# EAGLE design buderus_ems (EAGLE 9.2.2)
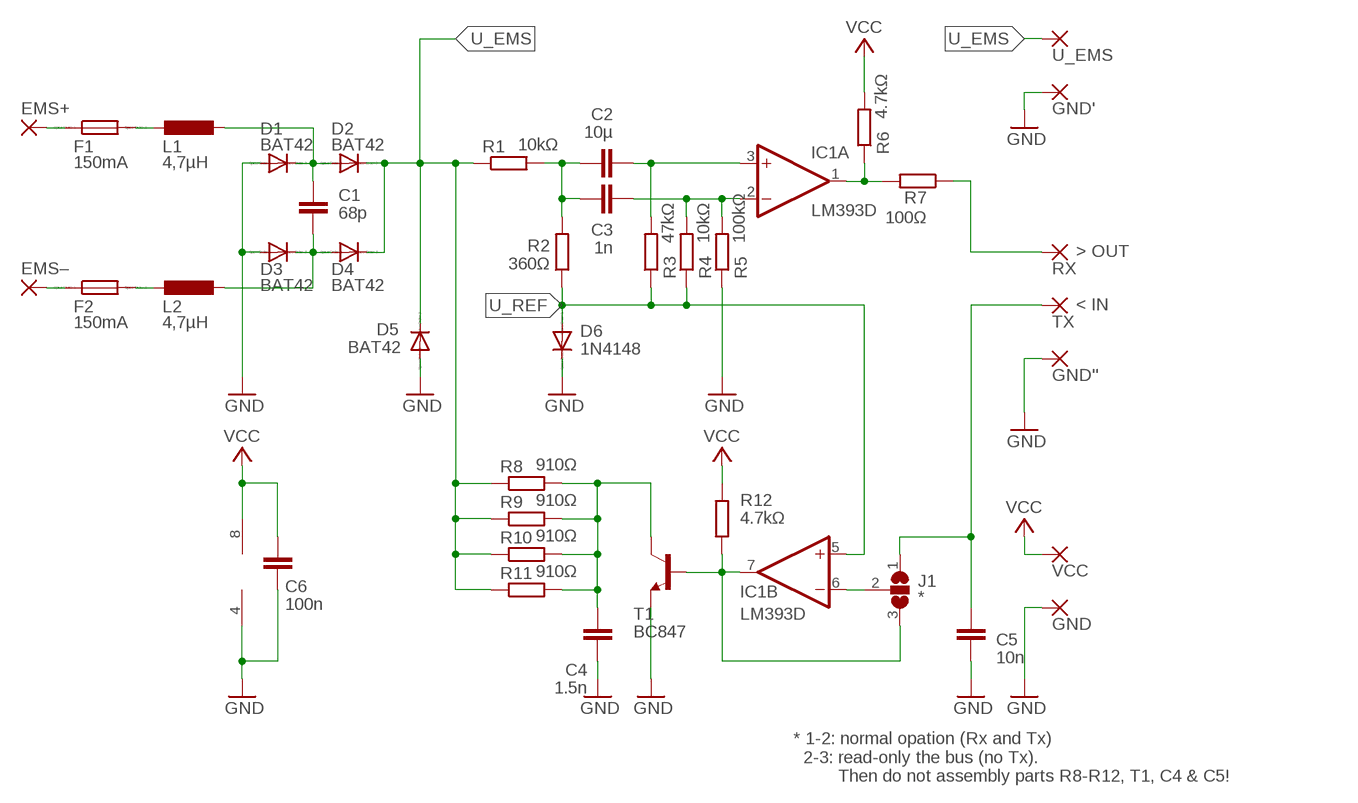
[diagram p0: schematic, sheet 1]

## Parts
C1  68p  C-EUC0603  [C0603]
C2  10µ  C-EUC0603  [C0603]
C3  1n  C-EUC0603  [C0603]
C4  1.5n  C-EUC0603  [C0603]
C5  10n  C-EUC0603  [C0603]
C6  100n  C-EUC0603  [C0603]
D1  BAT42  DIODE-MINIMELF  [MINIMELF]
D2  BAT42  DIODE-MINIMELF  [MINIMELF]
D3  BAT42  DIODE-MINIMELF  [MINIMELF]
D4  BAT42  DIODE-MINIMELF  [MINIMELF]
D5  BAT42  DIODE-MINIMELF  [MINIMELF]
D6  1N4148  DIODE-MINIMELF  [MINIMELF]
EMS+  WIREPAD2,15/1,0  [2,15/1,0]
EMS‒  WIREPAD2,15/1,0  [2,15/1,0]
F1  150mA  RR1210  [R1210]
F2  150mA  RR1210  [R1210]
GND  WIREPAD2,15/1,0  [2,15/1,0]
GND'  WIREPAD2,15/1,0  [2,15/1,0]
GND''  WIREPAD2,15/1,0  [2,15/1,0]
IC1  LM393D  [SO08]
J1  *  SJ2W  [SJ_2]
L1  4,7µH  L-EUL3216C  [L3216C]
L2  4,7µH  L-EUL3216C  [L3216C]
R1  10kΩ  R-EU_R0805  [R0805]
R2  360Ω  R-EU_R0805  [R0805]
R3  47kΩ  R-EU_R0805  [R0805]
R4  10kΩ  R-EU_R0805  [R0805]
R5  100kΩ  R-EU_R0805  [R0805]
R6  4.7kΩ  R-EU_R0805  [R0805]
R7  100Ω  R-EU_R0805  [R0805]
R8  910Ω  R-EU_R0805  [R0805]
R9  910Ω  R-EU_R0805  [R0805]
R10  910Ω  R-EU_R0805  [R0805]
R11  910Ω  R-EU_R0805  [R0805]
R12  4.7kΩ  R-EU_R0805  [R0805]
RX  WIREPAD2,15/1,0  [2,15/1,0]
T1  BC847  [SOT23]
TX  WIREPAD2,15/1,0  [2,15/1,0]
U_EMS  WIREPAD2,15/1,0  [2,15/1,0]
VCC  WIREPAD2,15/1,0  [2,15/1,0]

## Nets
EMS_1: C1.2 D1.C D2.A L1.2
EMS_2: C1.1 D3.C D4.A L2.2
EMS_RX: R7.1 RX.1(P)
EMS_TX: C5.2 J1.1 TX.1(P)
GND: C4.1 C5.1 C6.1 D1.A D3.A D5.A D6.C GND''.1(P) GND'.1(P) GND.1(P) IC1.4(P:V-) R5.1 T1.2(E)
N$2: IC1.7(B:OUT) J1.3 R12.1 T1.1(B)
N$3: IC1.6(B:-IN) J1.2
N$4: C3.2 IC1.2(A:-IN) R4.2 R5.2
N$5: C2.2 IC1.3(A:+IN) R3.2
N$6: IC1.1(A:OUT) R6.1 R7.2
N$7: EMS+.1(P) F1.1
N$8: EMS‒.1(P) F2.1
N$9: C4.2 R8.2 R9.2 R10.2 R11.2 T1.3(C)
N$10: F1.2 L1.1
N$11: F2.2 L2.1
N$12: C2.1 C3.1 R1.2 R2.2
U_EMS: D2.C D4.C D5.C R1.1 R8.1 R9.1 R10.1 R11.1 U_EMS.1(P)
U_REF: D6.A IC1.5(B:+IN) R2.1 R3.1 R4.1
VCC: C6.2 IC1.8(P:V+) R6.2 R12.2 VCC.1(P)

## Notes on the sheet
- > OUT
- < IN
- * 1-2: normal opation (Rx and Tx)
    2-3: read-only the bus (no Tx). 
           Then do not assembly parts R8-R12, T1, C4 & C5!

## Library data of the parts
C1-C6 = rcl:C-EU: CAPACITOR, European symbol; SPICEPREFIX: C
D1-D6 = diode:DIODE-: DIODE
EMS+ EMS‒ GND GND' GND'' RX TX U_EMS VCC = wirepad:WIREPAD: Wire PAD connect wire on PCB
F1 F2 = eagle-ltspice:R: RESISTOR, European symbol; SPICEMODEL: NONE; SPICEPREFIX: R
IC1 = linear:LM393: COMPARATOR
J1 = jumper:SJ2W: SMD solder JUMPER
L1 L2 = rcl:L-EU: INDUCTOR, European symbol; SPICEPREFIX: L
R1-R12 = rcl:R-EU_: RESISTOR, European symbol; SPICEPREFIX: R
T1 = transistor:BC847: NPN TRANSISTOR

## Board
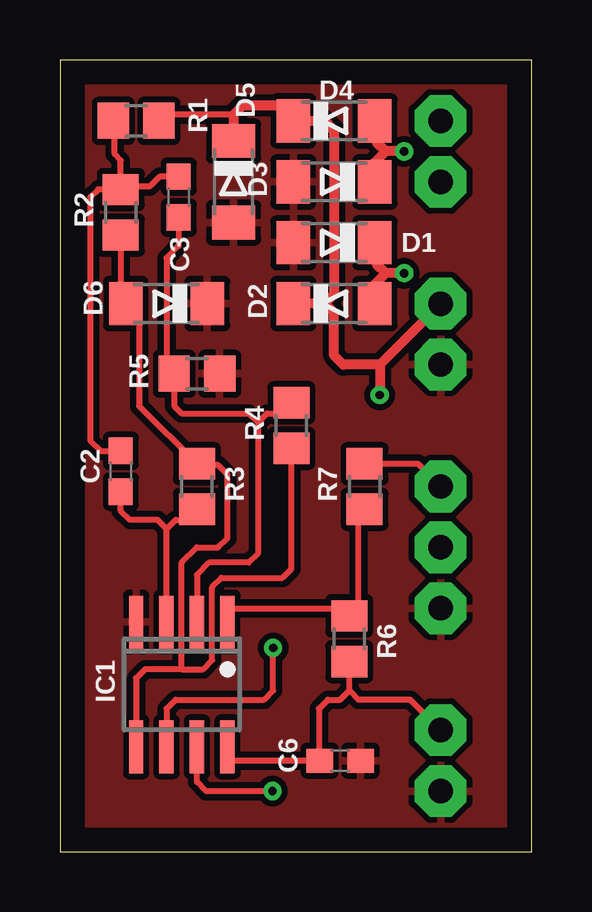
[diagram p1: board, top side]
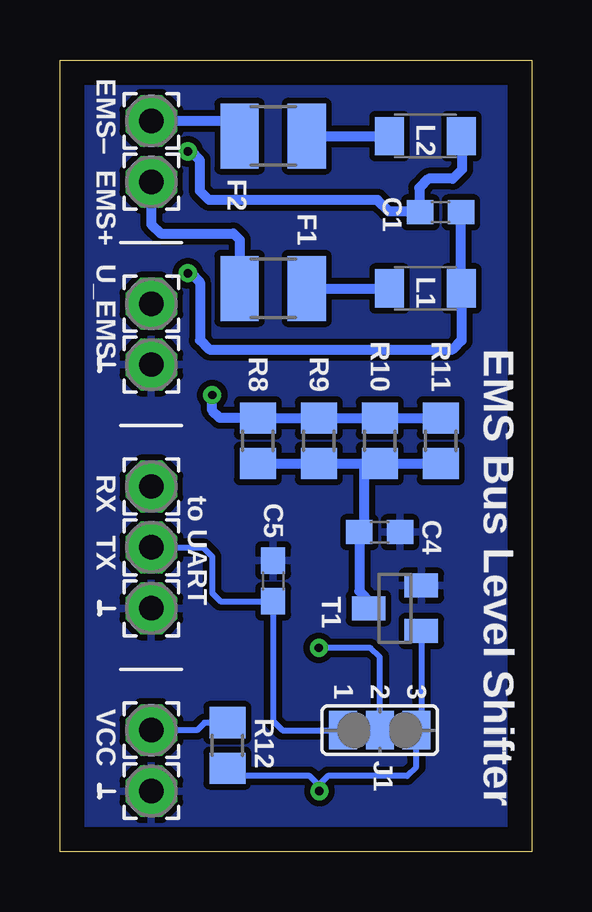
[diagram p2: board, bottom side, seen from below]

Size 19.68 x 33.02 mm. Coordinates in mm from the lower left corner, seen from the top.
Outline: 0,0 19.68,0 19.68,33.02 0,33.02 0,0
Copper layers (1*16): Top 0.035mm / dielectric 1.5mm / Bottom 0.035mm
Design rules "default *": minimum track width 6mil, minimum drill 0.35mm, track to track 6mil, track to pad 6mil, pad to pad 6mil, via to via 6mil, smd to smd 6mil, copper to edge 40mil, drill to drill 6mil, minimum pad ring 10mil, minimum via ring 8mil, stop-mask expansion 4mil, vias tented up to drill 0mil, thermal gap 10mil

### Footprints (pad centres in the part's own frame; a part is rotated, then mirrored left to right if it is on the bottom)
C0603 = smd 1.1 x 1: 1 -0.85,0; 2 0.85,0
MINIMELF = smd 1.4 x 1.8: A 1.7,0; C -1.7,0
2,15/1,0 = drill 1.016 pad 2.159 octagon: 1 0,0
R1210 = smd 1.6 x 2.7: 1 -1.4,0; 2 1.4,0
SO08 = smd 0.6 x 2.2: 1 -1.905,-2.6; 2 -0.635,-2.6; 3 0.635,-2.6; 4 1.905,-2.6; 5 1.905,2.6; 6 0.635,2.6; 7 -0.635,2.6; 8 -1.905,2.6
SJ_2 = smd 1.168 x 1.6: 1 -1.524,0; 2 0,0; 3 1.524,0
L3216C = smd 1.2 x 1.6: 1 -1.5,0; 2 1.5,0
R0805 = smd 1.3 x 1.5: 1 -0.95,0; 2 0.95,0
SOT23 = smd 1 x 1.4: 1 -0.95,-1.1; 2 0.95,-1.1; 3 0,1.1

### Placement (x,y rotation side)
C1  3.81,26.67 0 bottom
C2  2.54,15.88 270 top
C3  4.95,27.3 270 top
C4  6.35,13.34 180 bottom
C5  10.79,11.3 270 bottom
C6  11.68,3.81 180 top
D1  11.43,25.4 180 top
D2  11.43,22.86 0 top
D3  11.43,27.94 180 top
D4  11.43,30.48 0 top
D5  7.24,27.94 270 top
D6  4.45,22.86 180 top
EMS+  15.88,27.94 0 bottom
EMS‒  15.88,30.48 0 bottom
F1  10.79,23.5 0 bottom
F2  10.79,29.84 0 bottom
GND  15.88,2.54 0 bottom
GND'  15.88,20.32 0 bottom
GND''  15.88,10.16 0 bottom
IC1  5.08,6.99 180 top
J1  6.35,5.08 0 bottom
L1  4.45,23.5 0 bottom
L2  4.45,29.84 0 bottom
R1  3.18,30.48 180 top
R2  2.54,26.67 90 top
R3  5.71,15.24 270 top
R4  9.65,17.78 90 top
R5  5.71,19.94 180 top
R6  12.07,8.89 270 top
R7  12.7,15.24 270 top
R8  11.43,17.14 270 bottom
R9  8.89,17.14 270 bottom
R10  6.35,17.14 270 bottom
R11  3.81,17.14 270 bottom
R12  12.7,4.45 90 bottom
RX  15.88,15.24 0 bottom
T1  5.71,10.16 90 bottom
TX  15.88,12.7 0 bottom
U_EMS  15.88,22.86 0 bottom
VCC  15.88,5.08 0 bottom

### Tracks (layer width: path | path; a pad name or v marks a point on that pad's centre or on a via)
EMS_1  (via drill 0.35)
  Top 0.406: v14.35,24.13 13.59,24.13 | 13.59,24.13 13.21,24.51 13.21,25.32 D1.C | D2.A 13.13,23.67 13.59,24.13
  Bottom 0.406: C1.2 2.96,23.51 L1.2 2.94,21.31 3.3,20.95 13.46,20.95 13.84,21.34 13.84,23.75 14.22,24.13 v14.35,24.13
EMS_2  (via drill 0.35)
  Top 0.406: v14.35,29.21 13.59,29.21 | 13.59,29.21 13.21,29.59 13.21,30.4 D4.A | D3.C 13.13,28.75 13.59,29.21
  Bottom 0.406: L2.2 2.92,29.82 2.92,28.45 3.3,28.07 4.32,28.07 4.7,27.69 4.7,26.71 | 4.7,26.71 C1.1 | 4.7,26.71 5.97,26.71 6.44,27.18 13.46,27.18 13.84,27.56 13.84,28.83 14.22,29.21 v14.35,29.21
EMS_RX
  Top 0.254: R7.1 14.93,16.19 RX.1
EMS_TX
  Bottom 0.254: TX.1 13.72,12.7 13.34,12.32 13.34,10.79 12.99,10.45 C5.2 10.79,5.46 10.41,5.08 J1.1
GND
  pour Top (isolate 0.254): -1.27,33.02 20.96,33.02 20.96,0 -1.27,0
  pour Bottom (isolate 0.254): 20.32,33.02 -0.64,33.02 -0.64,0 20.32,0
  pour Top (isolate 0.254): 13.97,4.45 17.78,4.45 17.78,0.64 13.97,0.64
  pour Top (isolate 0.254): 13.97,12.06 17.78,12.06 17.78,8.26 13.97,8.26
  pour Top (isolate 0.254): 13.97,22.23 17.78,22.23 17.78,18.41 13.97,18.41
  pour Top (isolate 0.254): -0.64,33.02 20.32,33.02 20.32,0 -0.64,0
  pour Bottom (isolate 0.254): 20.96,33.02 -1.27,33.02 -1.27,0 20.96,0
N$2  (via drill 0.35)
  Top 0.254: v8.87,2.54 6.1,2.54 5.71,2.92 IC1.7
  Bottom 0.254: T1.1 4.62,5.29 J1.3 4.83,3.56 5.21,3.17 8.51,3.17 8.87,2.82 v8.87,2.54 8.87,2.77 9.27,3.17 12.38,3.17 R12.1
N$3  (via drill 0.35)
  Top 0.254: IC1.6 4.45,5.97 4.83,6.35 8.51,6.35 8.89,6.73 v8.89,8.51
  Bottom 0.254: J1.2 6.35,8.13 6.73,8.51 v8.89,8.51
N$4
  Top 0.254: 8.26,17.91 7.87,18.29 5.08,18.29 4.77,18.6 R5.2 4.45,20.26 4.45,24.77 4.95,25.27 C3.2 | R4.2 9.21,18.29 8.64,18.29 8.26,17.91 | IC1.2 5.71,11.56 6.22,12.06 7.87,12.06 8.26,12.45 8.26,17.91
N$5
  Top 0.254: IC1.3 4.45,13.46 | 4.45,13.46 4.83,13.84 5.27,13.84 R3.2 | 4.45,13.46 4.06,13.84 2.92,13.84 2.54,14.22 C2.2
N$6
  Top 0.254: R6.1 12.22,10 | 12.22,10 12.45,10.22 12.45,14.04 R7.2 | IC1.1 6.99,10.16 12.07,10.16 12.22,10
N$7
  Bottom 0.406: F1.1 12.2,24.26 12.19,24.26 12.19,25.53 12.45,25.78 15.49,25.78 15.88,26.16 EMS+.1
N$8
  Bottom 0.254: 12.7,30.48 12.2,29.98 F2.1
  Bottom 0.406: EMS‒.1 12.7,30.48
N$9
  Bottom 0.254: 6.99,16.2 R10.2
  Bottom 0.406: R10.2 R11.2 | R8.2 R9.2 6.99,16.2 6.99,13.55 C4.2 7.2,10.88 6.73,10.41 6.73,10.24 T1.3
N$10
  Bottom 0.406: F1.2 L1.1
N$11
  Bottom 0.406: F2.2 L2.1
N$12
  Top 0.254: C2.1 1.69,16.73 1.27,17.14 1.27,27.3 1.58,27.62 R2.2 | C3.1 4.15,28.16 3.74,27.75 2.67,27.75 R2.2 | R1.2 2.29,30.42 2.29,29.08 2.54,28.83 R2.2
U_EMS  (via drill 0.35)
  Top 0.254: 7.24,30.73 4.38,30.73 R1.1
  Top 0.406: 11.05,22.86 11.43,23.24 11.43,30.1 11.05,30.48 D4.C 9.1,31.11 7.62,31.11 7.24,30.73 D5.C | 11.05,22.86 D2.C | 11.05,22.86 11.43,22.48 11.43,20.7 11.81,20.32 13.34,20.32 | U_EMS.1 13.34,20.32 | 13.34,20.32 v13.34,19.05
  Bottom 0.406: R11.1 R10.1 R9.1 R8.1 13.02,18.09 13.34,18.41 v13.34,19.05
U_REF
  Top 0.254: R2.1 2.54,23.07 D6.A 2.74,22.66 3.3,22.1 3.3,18.6 R3.1 5.78,16.13 6.6,16.13 6.99,15.75 6.99,13.08 6.6,12.7 5.71,12.7 5.08,12.06 5.08,7.62 | R4.1 9.53,16.7 9.65,16.58 9.65,11.81 9.27,11.43 6.73,11.43 6.35,11.05 6.35,8 5.97,7.62 5.08,7.62 | IC1.5 3.18,7.24 3.56,7.62 5.08,7.62
VCC
  Top 0.254: 12.07,6.73 11.68,6.35 11.18,6.35 10.79,5.97 10.79,3.81 C6.2 6.99,3.81 IC1.8 | 12.07,6.73 R6.2 | VCC.1 14.61,6.35 12.45,6.35 12.07,6.73
  Bottom 0.254: R12.2 13.66,5.39 13.97,5.08 VCC.1

### Text on the board
bNames: to UART | 3 | 2 | 1 | EMS Bus Level Shifter